# EAGLE schematic 20ma (EAGLE 6.6.0)
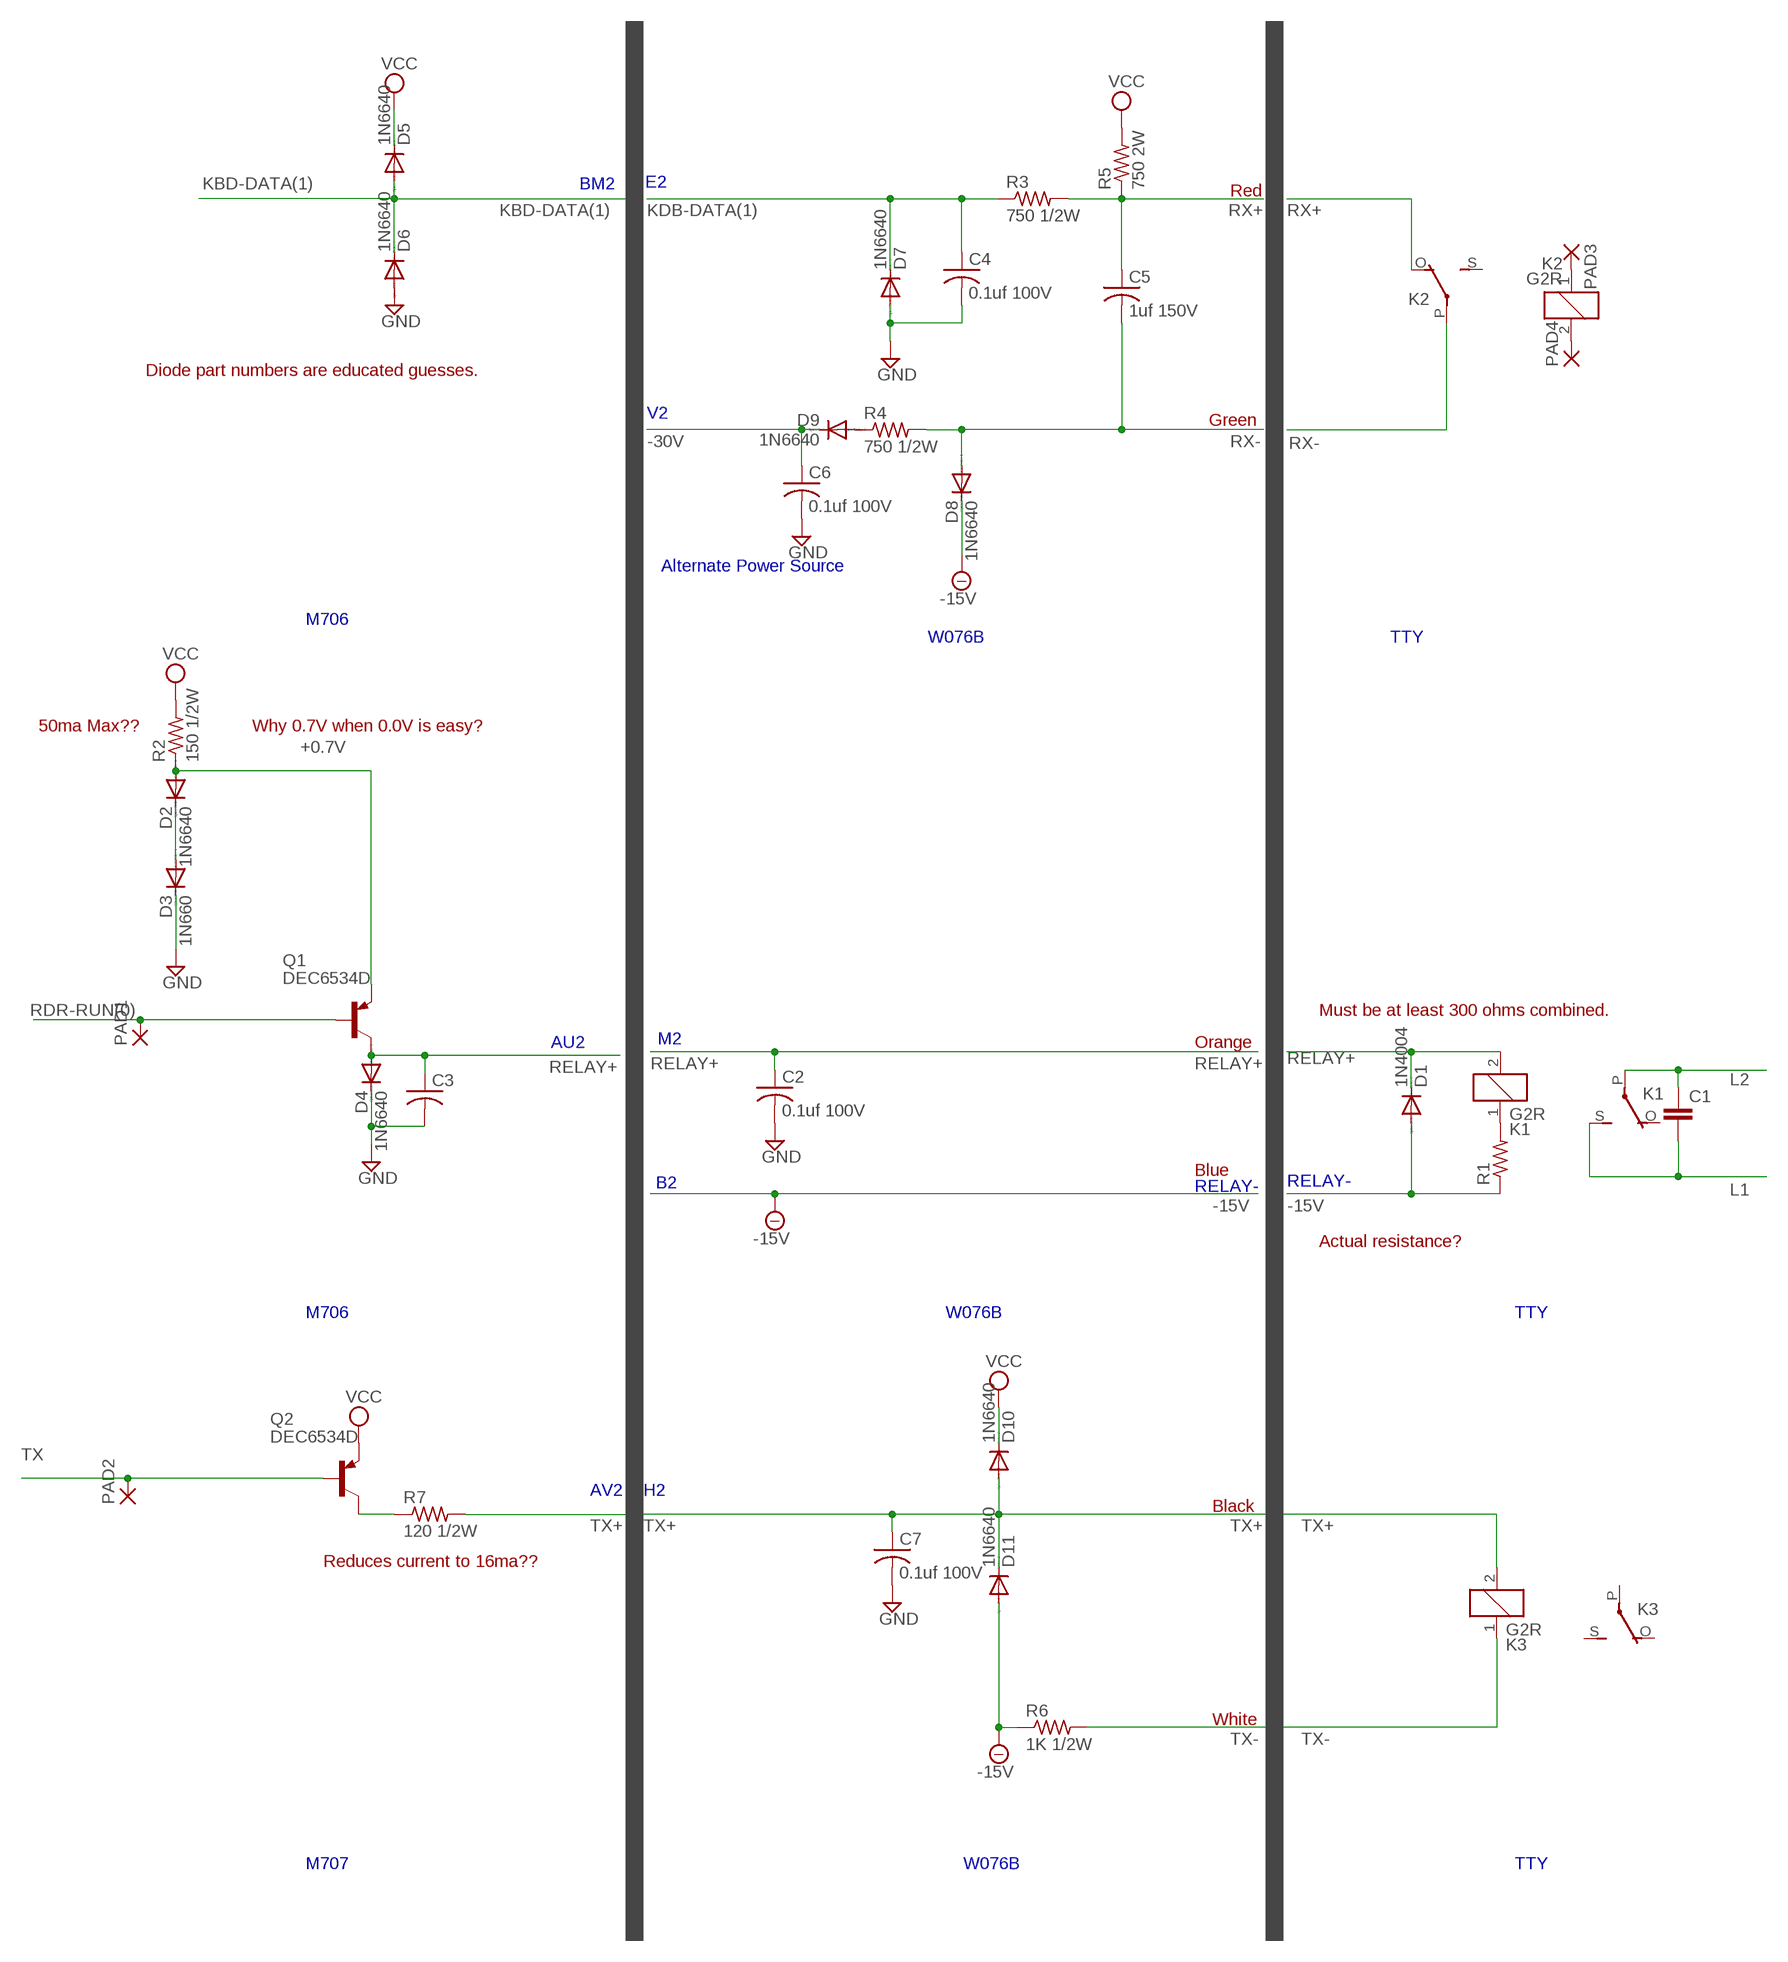
[diagram p0: schematic, sheet 1]

## Parts
C1  C22/10  [C22.5B10]
C2  0.1uf 100V  C-US025-025X050  [C025-025X050]
C3  C-US025-025X050  [C025-025X050]
C4  0.1uf 100V  C-US025-025X050  [C025-025X050]
C5  1uf 150V  C-US075-063X106  [C075-063X106]
C6  0.1uf 100V  C-US025-025X050  [C025-025X050]
C7  0.1uf 100V  C-US025-025X050  [C025-025X050]
D1  1N4004  [DO41-10]
D2  1N6640  1N4004  [DO41-10]
D3  1N660  1N4004  [DO41-10]
D4  1N6640  1N4004  [DO41-10]
D5  1N6640  1N4004  [DO41-10]
D6  1N6640  1N4004  [DO41-10]
D7  1N6640  1N4004  [DO41-10]
D8  1N6640  1N4004  [DO41-10]
D9  1N6640  1N4004  [DO41-10]
D10  1N6640  1N4004  [DO41-10]
D11  1N6640  1N4004  [DO41-10]
K1  G2R  [G2R]
K2  G2R  [G2R]
K3  G2R  [G2R]
PAD1  1,6/0,8  [1,6/0,8]
PAD2  1,6/0,8  [1,6/0,8]
PAD3  1,6/0,8  [1,6/0,8]
PAD4  1,6/0,8  [1,6/0,8]
Q1  DEC6534D  2N3906  [TO92]
Q2  DEC6534D  2N3906  [TO92]
R1  R-US_0309/12  [0309/12]
R2  150 1/2W  R-US_0207/10  [0207/10]
R3  750 1/2W  R-US_0309/12  [0309/12]
R4  750 1/2W  R-US_0309/12  [0309/12]
R5  750 2W  R-US_0309/12  [0309/12]
R6  1K 1/2W  R-US_0309/12  [0309/12]
R7  120 1/2W  R-US_0309/12  [0309/12]

## Nets
+0.7V: D2.A Q1.3(E) R2.1
-15V: D1.A D8.C D11.A R1.1 R6.1
-30V: C6.1 D9.C
GND: C2.2 C3.2 C4.2 C6.2 C7.2 D3.C D4.C D6.A D7.A
KBD-DATA(1): D5.A D6.C
KDB-DATA(1): C4.1 D7.C R3.1
L1: C1.2 K1.S(2:S)
L2: C1.1 K1.P(2:P)
N$1: K1.1 R1.2
N$2: D9.A R4.1
N$3: D2.C D3.A
N$4: Q2.1(C) R7.1
N$5: K2.1 PAD3.1(P)
N$6: K2.2 PAD4.1(P)
RDR-RUN(0): PAD1.1(P) Q1.2(B)
RELAY+: C2.1 C3.1 D1.C D4.A K1.2 Q1.1(C)
RX+: C5.1 K2.O(2:O) R3.2 R5.1
RX-: C5.2 D8.A K2.P(2:P) R4.2
TX: PAD2.1(P) Q2.2(B)
TX+: C7.1 D10.A D11.C K3.2 R7.2
TX-: K3.1 R6.2
VCC: D5.C D10.C Q2.3(E) R2.2 R5.2
Unconnected: K1.O(2:O) K2.S(2:S) K3.O(2:O) K3.P(2:P) K3.S(2:S)

## Notes on the sheet
- BM2 | E2
- Red
- Diode part numbers are educated guesses.
- V2
- Green
- Alternate Power Source
- M706
- W076B | TTY
- 50ma Max?? | Why 0.7V when 0.0V is easy?
- Must be at least 300 ohms combined.
- AU2 | M2 | Orange
- Blue
- B2 | RELAY-
- RELAY-
- Actual resistance?
- M706 | W076B | TTY
- AV2 | H2
- Black
- Reduces current to 16ma??
- White
- M707 | W076B | TTY

## Library data of the parts
C1 = capacitor-wima:C: CAPACITOR naming: grid - package width
C2-C7 = rcl:C-US: CAPACITOR, American symbol
D1-D11 = diode:1N4004: DIODE general purpose rectifier, 1 A
K1-K3 = relay:G2R: RELAY 1 x switch, Omron; OC_FARNELL: 1569185; OC_NEWARK: unknown
PAD1-PAD4 = wirepad:1,6/0,8: THROUGH-HOLE PAD
Q1 Q2 = transistor-pnp:2N3906: PNP Transistor
R1-R7 = rcl:R-US_: RESISTOR, American symbol